# EAGLE design SENSOR CAMERA 001 (EAGLE 5.10)
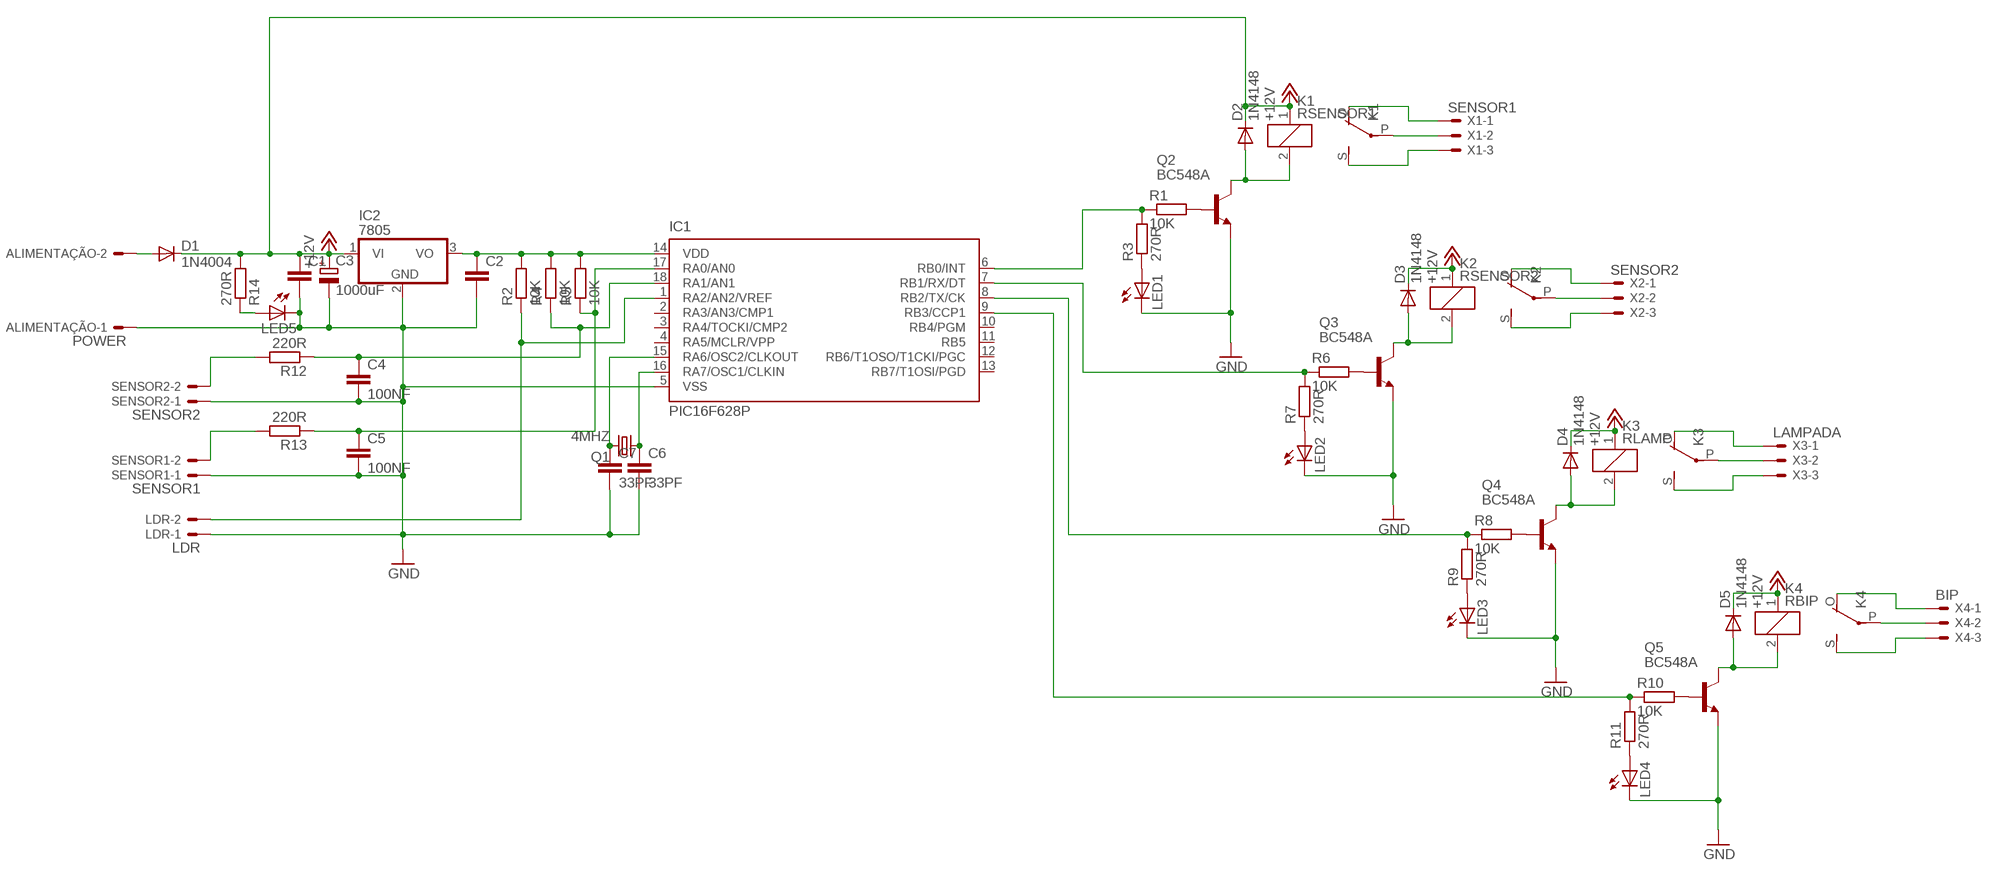
[diagram p0: schematic, sheet 1]

## Parts
ALIMENTAÇÃO  POWER  22-23-2021  [22-23-2021]
C1  C-EU075-032X103  [C075-032X103]
C2  C-EU075-032X103  [C075-032X103]
C3  1000uF  CPOL-EUE5-10.5  [E5-10,5]
C4  100NF  C-EU075-032X103  [C075-032X103]
C5  100NF  C-EU075-032X103  [C075-032X103]
C6  33PF  C-EU025-024X044  [C025-024X044]
C7  33PF  C-EU025-024X044  [C025-024X044]
D1  1N4004  [DO41-10]
D2  1N4148  1N4148DO35-7  [DO35-7]
D3  1N4148  1N4148DO35-7  [DO35-7]
D4  1N4148  1N4148DO35-7  [DO35-7]
D5  1N4148  1N4148DO35-7  [DO35-7]
IC1  PIC16F628P  [DIL18]
IC2  7805  7805TV  [TO220V]
K1  RSENSOR1  G5LE  [G5LE]
K2  RSENSOR2  G5LE  [G5LE]
K3  RLAMP  G5LE  [G5LE]
K4  RBIP  G5LE  [G5LE]
LDR  LDR  22-23-2021  [22-23-2021]
LED1  LED5MM  [LED5MM]
LED2  LED5MM  [LED5MM]
LED3  LED5MM  [LED5MM]
LED4  LED5MM  [LED5MM]
LED5  LED5MM  [LED5MM]
Q1  4MHZ  CRYSTALHC49U70  [HC49U70]
Q2  BC548A  [TO92-EBC]
Q3  BC548A  [TO92-EBC]
Q4  BC548A  [TO92-EBC]
Q5  BC548A  [TO92-EBC]
R1  10K  R-EU_0207/10  [0207/10]
R2  10K  R-EU_0207/10  [0207/10]
R3  270R  R-EU_0207/10  [0207/10]
R4  10K  R-EU_0207/10  [0207/10]
R5  10K  R-EU_0207/10  [0207/10]
R6  10K  R-EU_0207/10  [0207/10]
R7  270R  R-EU_0207/10  [0207/10]
R8  10K  R-EU_0207/10  [0207/10]
R9  270R  R-EU_0207/10  [0207/10]
R10  10K  R-EU_0207/10  [0207/10]
R11  270R  R-EU_0207/10  [0207/10]
R12  220R  R-EU_0207/10  [0207/10]
R13  220R  R-EU_0207/10  [0207/10]
R14  270R  R-EU_0207/10  [0207/10]
SENSOR1  SENSOR1  22-23-2021  [22-23-2021]
SENSOR2  SENSOR2  22-23-2021  [22-23-2021]
X1  SENSOR1  22-23-2031  [22-23-2031]
X2  SENSOR2  22-23-2031  [22-23-2031]
X3  LAMPADA  22-23-2031  [22-23-2031]
X4  BIP  22-23-2031  [22-23-2031]

## Nets
+12V: C1.1 C3.+ D1.C D2.C D3.C D4.C D5.C IC2.1(VI) K1.1 K2.1 K3.1 K4.1 R14.2
GND: ALIMENTAÇÃO.1 C1.2 C2.2 C3.- C4.2 C5.2 C6.2 C7.2 IC1.5(VSS) IC2.2(GND) LDR.1 LED1.K(C) LED2.K(C) LED3.K(C) LED4.K(C) LED5.K(C) Q2.E Q3.E Q4.E Q5.E SENSOR1.1 SENSOR2.1
N$1: ALIMENTAÇÃO.2 D1.A
N$3: IC1.6(RB0/INT) R1.1 R3.2
N$4: C2.1 IC1.14(VDD) IC2.3(VO) R2.2 R4.2 R5.2
N$5: K1.P(2:P) X1.2
N$6: K1.O(2:O) X1.1
N$7: K1.S(2:S) X1.3
N$8: D2.A K1.2 Q2.C
N$9: LED1.A R3.1
N$10: Q2.B R1.2
N$11: C5.1 IC1.17(RA0/AN0) R5.1 R13.1
N$12: C6.1 IC1.16(RA7/OSC1/CLKIN) Q1.1
N$13: IC1.1(RA2/AN2/VREF) LDR.2 R2.1
N$14: C4.1 IC1.18(RA1/AN1) R4.1 R12.1
N$15: C7.1 IC1.15(RA6/OSC2/CLKOUT) Q1.2
N$16: K2.P(2:P) X2.2
N$17: K2.O(2:O) X2.1
N$18: K2.S(2:S) X2.3
N$19: D3.A K2.2 Q3.C
N$20: Q3.B R6.2
N$21: R12.2 SENSOR2.2
N$22: LED2.A R7.1
N$23: K3.P(2:P) X3.2
N$24: K3.O(2:O) X3.1
N$25: K3.S(2:S) X3.3
N$26: D4.A K3.2 Q4.C
N$27: Q4.B R8.2
N$28: IC1.8(RB2/TX/CK) R8.1 R9.2
N$29: LED3.A R9.1
N$30: K4.P(2:P) X4.2
N$31: K4.O(2:O) X4.1
N$32: K4.S(2:S) X4.3
N$33: D5.A K4.2 Q5.C
N$34: Q5.B R10.2
N$35: R13.2 SENSOR1.2
N$36: LED4.A R11.1
N$37: IC1.9(RB3/CCP1) R10.1 R11.2
N$38: IC1.7(RB1/RX/DT) R6.1 R7.2
N$40: LED5.A R14.1
Unconnected: IC1.2(RA3/AN3/CMP1) IC1.3(RA4/TOCKI/CMP2) IC1.4(RA5/MCLR/VPP) IC1.10(RB4/PGM) IC1.11(RB5) IC1.12(RB6/T1OSO/T1CKI/PGC) IC1.13(RB7/T1OSI/PGD)

## Library data of the parts
ALIMENTAÇÃO LDR SENSOR1 SENSOR2 = con-molex:22-23-2021: .100" (2.54mm) Center Header - 2 Pin
C1 C2 C4-C7 = rcl:C-EU: CAPACITOR, European symbol
C3 = rcl:CPOL-EU: POLARIZED CAPACITOR, European symbol
D1 = diode:1N4004: DIODE general purpose rectifier, 1 A
D2-D5 = diode:1N4148: DIODE high speed (Philips)
IC1 = microchip:PIC16F62*: FLASH-Based 8-Bit CMOS Microcontroller Source: http://ww1.microchip.com/downloads/en/DeviceDoc/40300C.pdf
IC2 = linear:78*: Positive VOLTAGE REGULATOR Source: http://cache.national.com/ds/LM/LM78L05.pdf http://www.fairchildsemi.com/ds/LM/LM7805.pdf
K1-K4 = relay:G5LE: RELAY 1 x switch, 10 A/120 V AC, 8 A/30 V DC, Omron
LED1-LED5 = led:LED: LED OSRAM: - CHIPLED LG R971, LG N971, LY N971, LG Q971, LY Q971, LO R971, LY R971 LH N974, LH R974 LS Q976, LO Q976, LY Q976 LO Q996 - Hyper CHIPLED LW Q18S LB Q993, LB Q99A, LB R99A - SideLED LS A670, LO A670, LY A670, LG A670, LP A670 LB A673, LV A673, LT A673, LW A673 LH A674 LY A675 LS A676, LA A676, LO A676, LY A676, LW A676 LS A679, LY A679, LG A679 - Hyper Micro SIDELED® LS Y876, LA Y876, LO Y876, LY Y876 LT Y87S - SmartLED LW L88C, LW L88S LB L89C, LB L89S, LG L890 LS L89K, LO L89K, LY L89K LS L896, LA L896, LO L896, LY L896 - TOPLED LS T670, LO T670, LY T670, LG T670, LP T670 LSG T670, LSP T670, LSY T670, LOP T670, LYG T670 LG T671, LOG T671, LSG T671 LB T673, LV T673, LT T673, LW T673 LH T674 LS T676, LA T676, LO T676, LY T676, LB T676, LH T676, LSB T676, LW T676 LB T67C, LV T67C, LT T67C, LS T67K, LO T67K, LY T67K, LW E67C LS E67B, LA E67B, LO E67B, LY E67B, LB E67C, LV E67C, LT E67C LW T67C LS T679, LY T679, LG T679 LS T770, LO T770, LY T770, LG T770, LP T770 LB T773, LV T773, LT T773, LW T773 LH T774 LS E675, LA E675, LY E675, LS T675 LS T776, LA T776, LO T776, LY T776, LB T776 LHGB T686 LT T68C, LB T68C - Hyper Mini TOPLED® LB M676 - Mini TOPLED Santana® LG M470 LS M47K, LO M47K, LY M47K Source: http://www.osram.convergy.de LUXEON: - LUMILED® LXK2-PW12-R00, LXK2-PW12-S00, LXK2-PW14-U00, LXK2-PW14-V00 LXK2-PM12-R00, LXK2-PM12-S00, LXK2-PM14-U00 LXK2-PE12-Q00, LXK2-PE12-R00, LXK2-PE12-S00, LXK2-PE14-T00, LXK2-PE14-U00 LXK2-PB12-K00, LXK2-PB12-L00, LXK2-PB12-M00, LXK2-PB14-N00, LXK2-PB14-P00, LXK2-PB14-Q00 LXK2-PR12-L00, LXK2-PR12-M00, LXK2-PR14-Q00, LXK2-PR14-R00 LXK2-PD12-Q00, LXK2-PD12-R00, LXK2-PD12-S00 LXK2-PH12-R00, LXK2-PH12-S00 LXK2-PL12-P00, LXK2-PL12-Q00, LXK2-PL12-R00 Source: www.luxeon.com KINGBRIGHT: KA-3528ASYC Source: www.kingbright.com
Q1 = crystal:CRYSTAL: CRYSTAL
Q2-Q5 = transistor-npn:BC548*: NPN Transistor
R1-R14 = rcl:R-EU_: RESISTOR, European symbol
X1-X4 = con-molex:22-23-2031: .100" (2.54mm) Center Header - 3 Pin

## Board
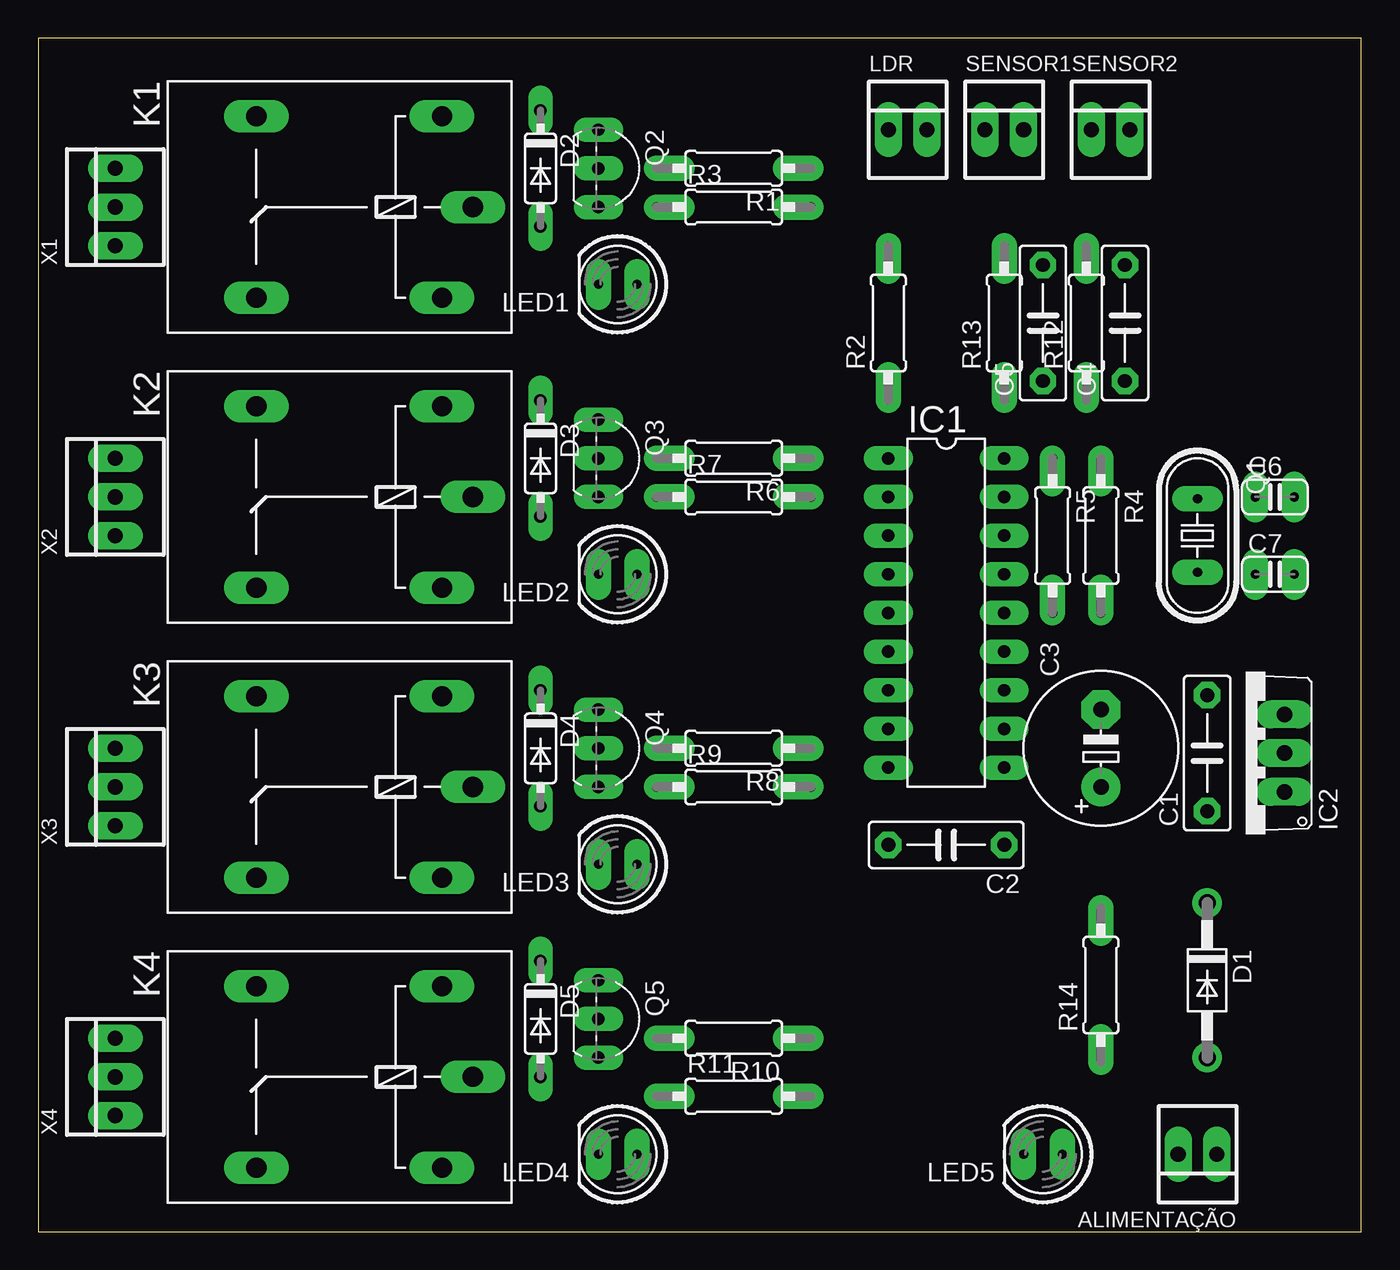
[diagram p1: board, top side]
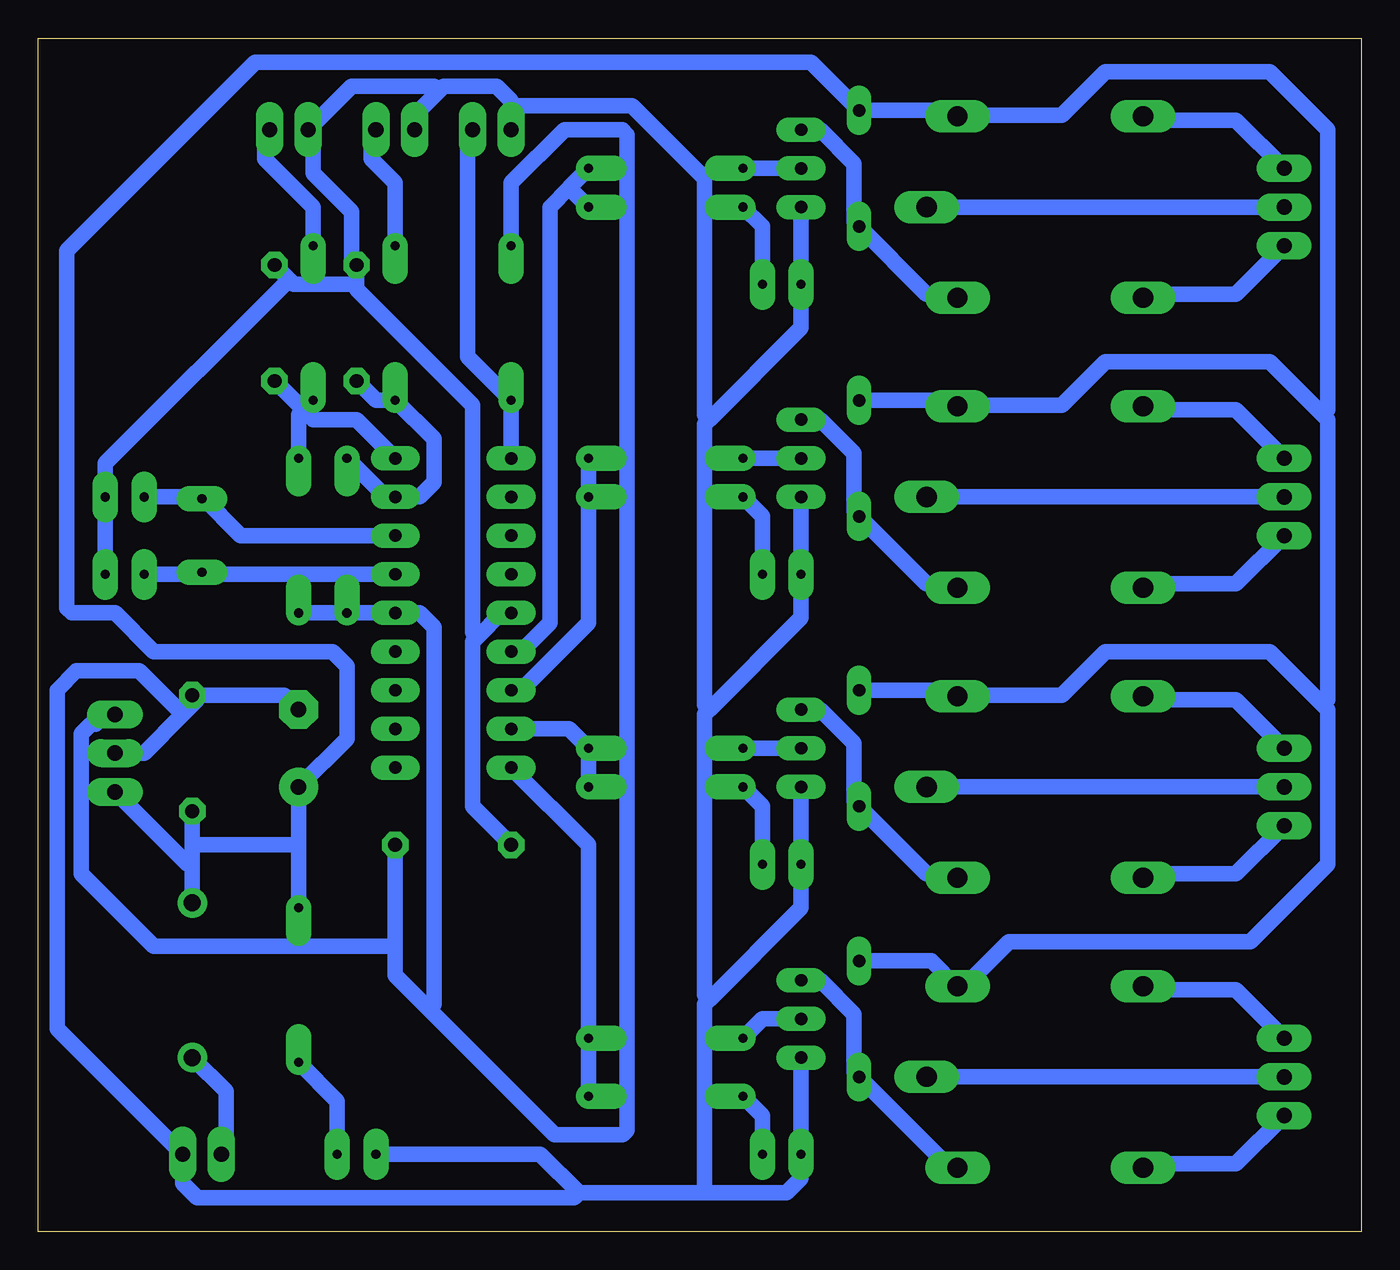
[diagram p2: board, bottom side, seen from below]

Size 86.97 x 78.41 mm. Coordinates in mm from the lower left corner, seen from the top.
Outline: 0,0 86.97,0 86.97,78.41 0,78.41 0,0
Copper layers (1*16): Top 0.035mm / dielectric 1.5mm / Bottom 0.035mm
Design rules "MUITO BOM FONTE": minimum track width 40mil, minimum drill 5mil, track to track 20mil, track to pad 20mil, pad to pad 20mil, via to via 20mil, smd to smd 20mil, copper to edge 20mil, drill to drill 20mil, minimum pad ring 16mil, minimum via ring 16mil, stop-mask expansion 4mil, vias tented up to drill 0mil, thermal gap 10mil

### Footprints (pad centres in the part's own frame; a part is rotated, then mirrored left to right if it is on the bottom)
22-23-2021 = drill 1 long: 1 -1.27,0; 2 1.27,0
C075-032X103 = drill 0.914 octagon: 1 -3.81,0; 2 3.81,0
E5-10,5 = drill 1.016 pad 2.54 round: + -2.54,0 | drill 1.016 pad 2.54 octagon: - 2.54,0
C025-024X044 = drill 0.6 pad 1.676 long: 1 -1.27,0; 2 1.27,0
DO41-10 = drill 1.118 round: A 5.08,0; C -5.08,0
DO35-7 = drill 0.813 long: A 3.81,0; C -3.81,0
DIL18 = drill 0.813 long: 1 -10.16,-3.81; 2 -7.62,-3.81; 3 -5.08,-3.81; 4 -2.54,-3.81; 5 0,-3.81; 6 2.54,-3.81; 7 5.08,-3.81; 8 7.62,-3.81; 9 10.16,-3.81; 10 10.16,3.81; 11 7.62,3.81; 12 5.08,3.81; 13 2.54,3.81; 14 0,3.81; 15 -2.54,3.81; 16 -5.08,3.81; 17 -7.62,3.81; 18 -10.16,3.81
TO220V = drill 1.016 long: 1 -2.54,-2.54; 2 0,-2.54; 3 2.54,-2.54
G5LE = drill 1.321 long: 1 -7.493,-5.969; 2 -7.493,5.969; O 4.699,5.969; P -9.525,0; S 4.699,-5.969
LED5MM = drill 0.6 pad 1.676 long: A -1.27,0; K 1.27,0
HC49U70 = drill 0.6 pad 1.676 long: 1 -2.413,0; 2 2.413,0
TO92-EBC = drill 0.813 long: B 0,-1.27; C -2.54,-1.27; E 2.54,-1.27
0207/10 = drill 0.6 pad 1.676 offset: 1 -5.08,0; 2 5.08,0
22-23-2031 = drill 1 long: 1 -2.54,0; 2 0,0; 3 2.54,0

### Placement (x,y rotation side)
ALIMENTAÇÃO  76.2,5.08 180 top
C1  76.83,31.43 90 top
C2  59.69,25.4 180 top
C3  69.85,31.75 90 top
C4  71.44,59.69 90 top
C5  66.04,59.69 90 top
C6  81.28,48.26 0 top
C7  81.28,43.18 0 top
D1  76.83,16.51 270 top
D2  33.02,69.85 270 top
D3  33.02,50.8 270 top
D4  33.02,31.75 270 top
D5  33.02,13.97 270 top
IC1  59.69,40.64 270 top
IC2  79.38,31.43 90 top
K1  19.05,67.31 180 top
K2  19.05,48.26 180 top
K3  19.05,29.21 180 top
K4  19.05,10.16 180 top
LDR  57.15,72.39 0 top
LED1  38.1,62.23 180 top
LED2  38.1,43.18 180 top
LED3  38.1,24.13 180 top
LED4  38.1,5.08 180 top
LED5  66.04,5.08 180 top
Q1  76.2,45.72 270 top
Q2  38.1,69.85 270 top
Q3  38.1,50.8 270 top
Q4  38.1,31.75 270 top
Q5  38.1,13.97 270 top
R1  45.72,69.85 180 top
R2  55.88,59.69 90 top
R3  45.72,67.31 0 top
R4  69.85,45.72 270 top
R5  66.67,45.72 270 top
R6  45.72,50.8 180 top
R7  45.72,48.26 0 top
R8  45.72,31.75 180 top
R9  45.72,29.21 0 top
R10  45.72,12.7 180 top
R11  45.72,8.89 0 top
R12  68.9,59.69 90 top
R13  63.5,59.69 90 top
R14  69.85,16.19 90 top
SENSOR1  63.5,72.39 0 top
SENSOR2  70.48,72.39 0 top
X1  5.08,67.31 90 top
X2  5.08,48.26 90 top
X3  5.08,29.21 90 top
X4  5.08,10.16 90 top

### Tracks (layer width: path | path; a pad name or v marks a point on that pad's centre or on a via)
+12V
  Bottom 1.016: 69.85,25.4 C3.+ 66.67,32.38 66.67,37.15 67.63,38.1 79.38,38.1 81.92,40.64 84.77,40.64 85.09,40.96 85.09,64.45 72.71,76.83 36.2,76.83 D2.C 26.99,73.66 26.67,73.34 K1.1 26.04,73.34 19.68,73.34 16.83,76.2 6.03,76.2 2.22,72.39 2.22,53.98 2.54,53.66 | 69.85,25.4 R14.2 | 76.83,24.13 D1.C | 76.83,25.4 76.83,24.13 | 76.83,25.4 C1.1 | IC2.1 77.15,24.13 76.83,24.13 | 69.85,25.4 76.83,25.4 | D3.C 26.99,54.61 26.67,54.29 K2.1 26.04,54.29 19.68,54.29 16.83,57.15 6.03,57.15 2.54,53.66 | D4.C 26.99,35.56 26.67,35.24 K3.1 26.04,35.24 19.68,35.24 16.83,38.1 6.03,38.1 2.54,34.61 | D5.C 28.26,17.78 26.67,16.19 K4.1 26.04,16.19 23.18,19.05 7.3,19.05 2.22,24.13 2.22,34.29 2.54,34.61 | 2.54,53.66 2.22,53.34 2.22,34.92 2.54,34.61
GND
  Bottom 1.016: 55.88,73.98 55.88,74.3 56.83,75.25 60.33,75.25 60.64,74.93 | 55.88,73.98 LDR.1 | 60.64,74.93 61.91,73.66 61.91,72.71 SENSOR1.1 | 60.64,74.93 60.96,75.25 66.36,75.25 SENSOR2.1 68.9,72.07 68.9,69.53 66.36,66.99 66.36,63.82 C5.2 66.04,62.23 | C7.2 C6.2 82.55,50.48 70.48,62.55 | IC1.5 56.52,40.64 58.1,39.05 | 58.1,39.05 58.42,38.73 58.42,27.94 C2.2 | 66.04,62.23 66.04,61.91 58.42,54.29 58.42,39.37 58.1,39.05 | 70.48,62.55 70.17,62.23 66.04,62.23 | 70.48,62.55 C4.2 | C3.- 70.8,35.24 C1.2 76.52,34.92 77.47,33.97 | IC2.2 80.01,31.43 77.47,33.97 | Q2.E LED1.K 36.83,59.37 42.86,53.34 | Q3.E LED2.K 36.83,40.32 42.86,34.29 | Q4.E LED3.K 36.83,21.27 42.86,15.24 | Q5.E LED4.K 36.83,3.49 37.78,2.54 43.18,2.54 | LED5.K 53.98,5.08 51.44,2.54 | 43.18,2.54 51.44,2.54 | 51.44,2.54 51.75,2.22 76.52,2.22 77.47,3.17 ALIMENTAÇÃO.1 85.72,13.34 85.72,35.56 84.45,36.83 80.33,36.83 77.47,33.97 | 42.86,15.24 43.18,14.92 43.18,2.54 | 42.86,34.29 43.18,33.97 43.18,15.56 42.86,15.24 | 42.86,53.34 43.18,53.02 43.18,34.61 42.86,34.29 | 55.88,73.98 47.94,73.98 43.18,69.22 43.18,53.66 42.86,53.34
N$1
  Bottom 1.016: ALIMENTAÇÃO.2 74.61,5.4 74.61,9.21 D1.A
N$3
  Bottom 1.016: IC1.6 55.24,38.1 53.34,40.01 53.34,67.31 52.07,68.58 | 52.07,68.58 R1.1 | 52.07,68.58 R3.2
N$4
  Bottom 1.016: R4.2 R5.2 IC1.14 61.91,40.64 60.96,39.69 60.96,14.92 61.28,14.61 | R2.2 55.88,68.9 52.39,72.39 48.58,72.39 48.26,72.07 48.26,6.67 48.58,6.35 53.02,6.35 61.28,14.61 | 61.28,14.61 63.5,16.83 63.5,18.73 | 63.5,18.73 C2.1 | IC2.3 82.55,33.97 83.19,33.34 83.5,33.34 84.14,32.7 84.14,23.5 79.38,18.73 63.5,18.73
N$5
  Bottom 1.016: X1.2 K1.P
N$6
  Bottom 1.016: X1.1 8.26,61.59 14.29,61.59 K1.O
N$7
  Bottom 1.016: X1.3 8.26,73.03 14.29,73.03 K1.S
N$8
  Bottom 1.016: K1.2 26.67,61.59 28.57,61.59 D2.A 33.34,66.36 33.34,70.17 35.56,72.39 Q2.C
N$9
  Bottom 1.016: LED1.A 39.37,66.04 R3.1
N$10
  Bottom 1.016: Q2.B R1.2
N$11
  Bottom 1.016: C5.1 64.77,54.61 R13.1 60.96,52.07 60.96,49.21 61.91,48.26 IC1.17 64.14,48.26 R5.1
N$12
  Bottom 1.016: IC1.16 73.66,45.72 76.2,48.26 Q1.1 76.52,48.26 C6.1
N$13
  Bottom 1.016: IC1.1 R2.1 58.74,57.47 58.74,72.07 LDR.2
N$14
  Bottom 1.016: IC1.18 66.04,53.34 68.9,53.34 69.53,53.98 | 69.53,53.98 C4.1 | R4.1 69.85,53.66 69.53,53.98 | 69.53,53.98 R12.1
N$15
  Bottom 1.016: IC1.15 76.2,43.18 Q1.2 76.52,43.18 C7.1
N$16
  Bottom 1.016: X2.2 K2.P
N$17
  Bottom 1.016: X2.1 8.26,42.55 14.29,42.55 K2.O
N$18
  Bottom 1.016: X2.3 8.26,53.98 14.29,53.98 K2.S
N$19
  Bottom 1.016: K2.2 26.67,42.55 28.57,42.55 D3.A 33.34,47.31 33.34,51.12 35.56,53.34 Q3.C
N$20
  Bottom 1.016: Q3.B R6.2
N$21
  Bottom 1.016: R12.2 68.9,67.31 72.07,70.48 72.07,72.07 SENSOR2.2
N$22
  Bottom 1.016: LED2.A 39.37,46.99 R7.1
N$23
  Bottom 1.016: X3.2 K3.P
N$24
  Bottom 1.016: X3.1 8.26,23.5 14.29,23.5 K3.O
N$25
  Bottom 1.016: X3.3 8.26,34.92 14.29,34.92 K3.S
N$26
  Bottom 1.016: K3.2 26.67,23.5 28.57,23.5 D4.A 33.34,28.26 33.34,32.07 35.56,34.29 Q4.C
N$27
  Bottom 1.016: Q4.B R8.2
N$28
  Bottom 1.016: IC1.8 52.07,33.02 R8.1 R9.2
N$29
  Bottom 1.016: LED3.A 39.37,27.94 R9.1
N$30
  Bottom 1.016: X4.2 K4.P
N$31
  Bottom 1.016: X4.1 8.26,4.45 14.29,4.45 K4.O
N$32
  Bottom 1.016: X4.3 8.26,15.88 14.29,15.88 K4.S
N$33
  Bottom 1.016: K4.2 26.67,4.45 27.3,4.45 D5.A 33.34,10.48 33.34,14.29 35.56,16.51 Q5.C
N$34
  Bottom 1.016: Q5.B 39.37,13.97 R10.2
N$35
  Bottom 1.016: R13.2 63.5,68.9 65.09,70.48 65.09,72.07 SENSOR1.2
N$36
  Bottom 1.016: LED4.A 39.37,7.62 R11.1
N$37
  Bottom 1.016: IC1.9 50.8,25.4 R10.1 R11.2
N$38
  Bottom 1.016: IC1.7 55.24,35.56 50.8,40.01 R7.2 R6.1
N$40
  Bottom 1.016: LED5.A 67.31,8.57 R14.1